# Altium schematic sheet _Block_level_sheet.SchDoc: Sitara
size A4; CompanyName: SPAN; Engineer: Goverdhan; Organization: University of Utah; Address1: 50 S Central Campus Dr; Address2: MEB Rm 3129; Address3: Salt Lake City, Utah 84115; Address4: USA; Revision: 1; SheetNumber: 1; SheetTotal: 4
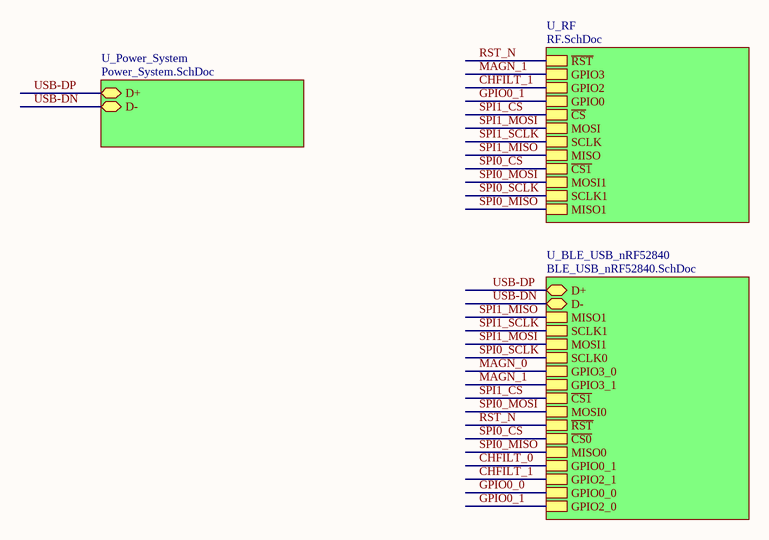
[diagram p0: _Block_level_sheet.SchDoc]

## Sub-sheets
U_BLE_USB_nRF52840 = BLE_USB_nRF52840.SchDoc: D+ (bidir), D- (bidir), MISO1, SCLK1, MOSI1, SCLK0, GPIO3_0, GPIO3_1, ~{CS1}, MOSI0, ~{RST}, ~{CS0}, MISO0, GPIO0_1, GPIO2_1, GPIO0_0, GPIO2_0
U_Power_System = Power_System.SchDoc: D+ (bidir), D- (bidir)
U_RF = RF.SchDoc: ~{CS1}, MISO1, MOSI1, SCLK1, GPIO3, GPIO2, MISO, GPIO0, ~{CS}, ~{RST}, SCLK, MOSI

## Nets
CHFILT_0: sheet U_BLE_USB_nRF52840/GPIO0_1
CHFILT_1: sheet U_BLE_USB_nRF52840/GPIO2_1, sheet U_RF/GPIO2
GPIO0_0: sheet U_BLE_USB_nRF52840/GPIO0_0
GPIO0_1: sheet U_BLE_USB_nRF52840/GPIO2_0, sheet U_RF/GPIO0
MAGN_0: sheet U_BLE_USB_nRF52840/GPIO3_0
MAGN_1: sheet U_BLE_USB_nRF52840/GPIO3_1, sheet U_RF/GPIO3
RST_N: sheet U_BLE_USB_nRF52840/~{RST}, sheet U_RF/~{RST}
SPI0_CS: sheet U_BLE_USB_nRF52840/~{CS0}, sheet U_RF/~{CS1}
SPI0_MISO: sheet U_BLE_USB_nRF52840/MISO0, sheet U_RF/MISO1
SPI0_MOSI: sheet U_BLE_USB_nRF52840/MOSI0, sheet U_RF/MOSI1
SPI0_SCLK: sheet U_BLE_USB_nRF52840/SCLK0, sheet U_RF/SCLK1
SPI1_CS: sheet U_BLE_USB_nRF52840/~{CS1}, sheet U_RF/~{CS}
SPI1_MISO: sheet U_BLE_USB_nRF52840/MISO1, sheet U_RF/MISO
SPI1_MOSI: sheet U_BLE_USB_nRF52840/MOSI1, sheet U_RF/MOSI
SPI1_SCLK: sheet U_BLE_USB_nRF52840/SCLK1, sheet U_RF/SCLK
USB-DN: sheet U_Power_System/D-, sheet U_BLE_USB_nRF52840/D-
USB-DP: sheet U_Power_System/D+, sheet U_BLE_USB_nRF52840/D+

## Notes on the sheet
- Title
- Designed by:
- Date:
- Time:
- Revision:
- Sheet
- of
- File: